# Altium schematic sheet UART_COM.SchDoc
size A4; SheetNumber: 8; SheetTotal: 8
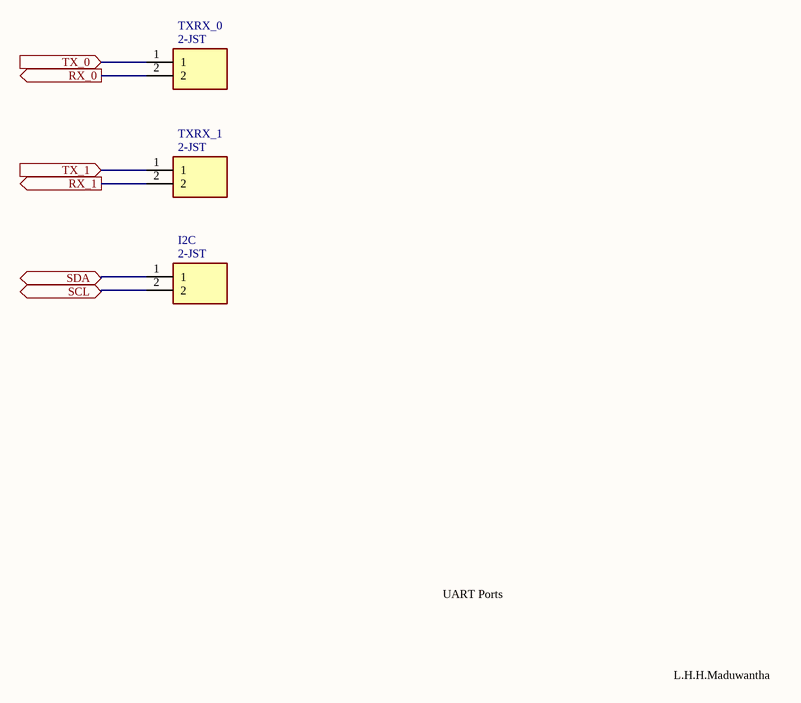
[diagram p0: UART_COM.SchDoc]

## Parts
I2C  Name: 2-JST  [B2BXHAMLFSN]  (hidden comment: B2B-XH-AM_LF__SN_)
TXRX_0  Name: 2-JST  [B2BXHAMLFSN]  (hidden comment: B2B-XH-AM_LF__SN_)
TXRX_1  Name: 2-JST  [B2BXHAMLFSN]  (hidden comment: B2B-XH-AM_LF__SN_)

## Ports
RX_0 (out, see Main[3B], MCU[2D]), RX_1 (out, see Main[3C], MCU[4B]), SCL (bidir, see Main[3C], MCU[4B], PressureSensor[2C]), SDA (bidir, see Main[3C], MCU[4B], PressureSensor[2C]), TX_0 (in, see Main[3B], MCU[2D]), TX_1 (in, see Main[3C], MCU[4B])

## Nets
RX_0: TXRX_0.2 ; port RX_0
RX_1: TXRX_1.2 ; port RX_1
SCL: I2C.2 ; port SCL
SDA: I2C.1 ; port SDA
TX_0: TXRX_0.1 ; port TX_0
TX_1: TXRX_1.1 ; port TX_1

## Notes on the sheet
- UART Ports
- L.H.H.Maduwantha

## Library data of the parts
I2C TXRX_0 TXRX_1 = B2B-XH-AM_LF__SN_: Connector; Manufacturer_Name: JST (JAPAN SOLDERLESS TERMINALS); Manufacturer_Part_Number: B2B-XH-AM(LF)(SN); Datasheet Link: https://www.jst-mfg.com/product/pdf/eng/eXH.pdf; Height: 7mm; Arrow Part Number: B2B-XH-AM(LF)(SN); Arrow Price/Stock: https://www.arrow.com/en/products/b2b-xh-am-lf-sn/jst-manufacturing?region=europe